# Altium project MDBT42Q.PrjPCB
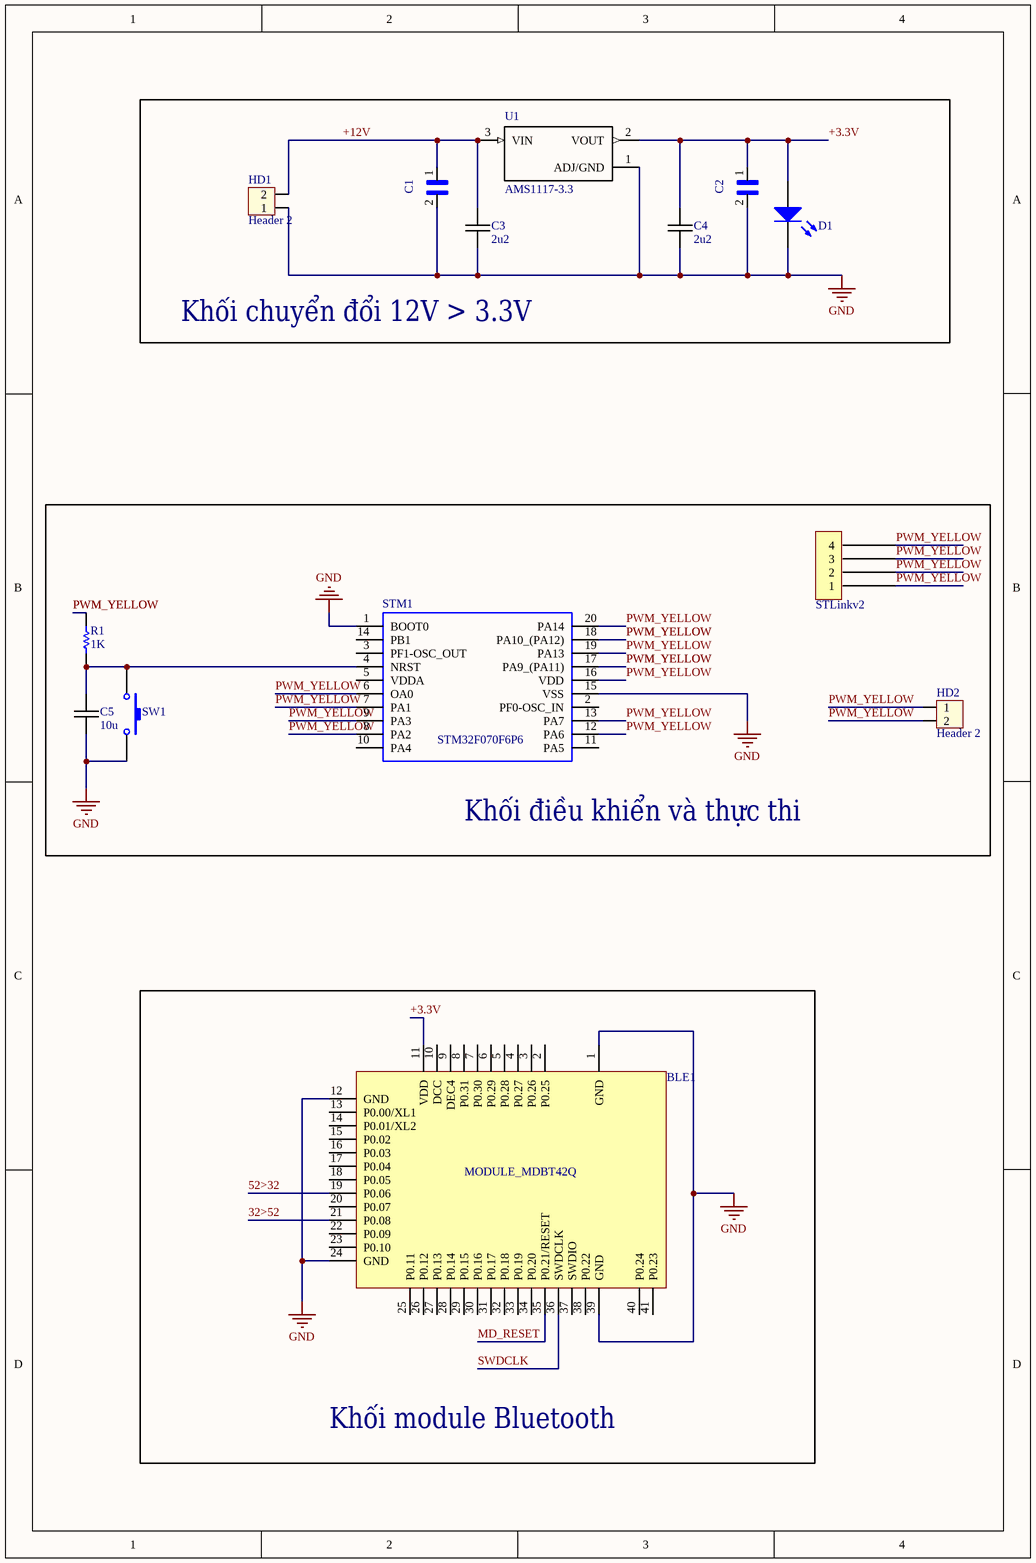
[diagram p0: MDBT42Q.SchDoc]
1 sheet, 14 parts. Net scope: global (net labels, ports and power ports of the same name join across sheets).
Board file: MDBT42Q.PcbDoc

## Sheet MDBT42Q.SchDoc
size A4 portrait

### Parts
BLE1  MODULE_MDBT42Q  [PCB_MDBT42Q_10X16]
C1  C3216X5R1A106K160AB  [CAPC3216X180]  (value not drawn)
C2  C3216X5R1A106K160AB  [CAPC3216X180]  (value not drawn)
C3  2u2  [0805C-GENERIC]
C4  2u2  [0805C-GENERIC]
C5  10u  [0805C-GENERIC]
D1  LED SMD  [LED_0805_Blue]  (value not drawn)
HD1  Header 2  [HED2]
HD2  Header 2  [HED2]
R1  value 1K  [RES-SM-1206]  (hidden comment: RESISTOR SMD)
STLinkv2  JP  [Jumper 4x1]  (value not drawn)
STM1  STM32F070F6P6  [SOP65P640X120-20N]
SW1  SW  [SW2]  (value not drawn)
U1  AMS1117-3.3  [SOT229P700X180-4N]

### Blocks framed on the sheet
Khối chuyển đổi 12V > 3.3V: C1-C4 D1 HD1 U1
Khối điều khiển và thực thi: C5 HD2 R1 STLinkv2 STM1 SW1
Khối module Bluetooth: BLE1

### Nets
GND: BLE1.1(GND) BLE1.12(GND) BLE1.24(GND) BLE1.39(GND) C1.2 C2.2 C3.2 C4.2 C5.2 D1.2(K) HD1.1 STM1.1(BOOT0) STM1.15(VSS) SW1.2 U1.1(ADJ/GND)
32>52: BLE1.21(P0.08)
52>32: BLE1.19(P0.06)
+3.3V: BLE1.11(VDD) C2.1 C4.1 D1.1(A) U1.2(VOUT)
+12V: C1.1 C3.1 HD1.2 U1.3(VIN)
MD_RESET: BLE1.35(P0.21/RESET)
PWM_YELLOW: HD2.1 HD2.2 R1.2 STLinkv2.1 STLinkv2.2 STLinkv2.3 STLinkv2.4 STM1.6(OA0) STM1.7(PA1) STM1.8(PA2) STM1.9(PA3) STM1.12(PA6) STM1.13(PA7) STM1.16(VDD) STM1.17(PA9_(PA11)) STM1.18(PA10_(PA12)) STM1.19(PA13) STM1.20(PA14)
SWDCLK: BLE1.36(SWDCLK)
NetC5_1: C5.1 R1.1 STM1.4(NRST) SW1.1

Not connected (* = marked no-connect by the designer): BLE1 2(P0.25) 3(P0.26) 4(P0.27) 5(P0.28) 6(P0.29) 7(P0.30) 8(P0.31) 9(DEC4) 10(DCC) 13(P0.00/XL1) 14(P0.01/XL2) 15(P0.02) 16(P0.03) 17(P0.04) 18(P0.05) 20(P0.07) 22(P0.09) 23(P0.10) 25(P0.11) 26(P0.12) 27(P0.13) 28(P0.14) 29(P0.15) 30(P0.16) 31(P0.17) 32(P0.18) 33(P0.19) 34(P0.20) 37(SWDIO) 38(P0.22) 40(P0.24) 41(P0.23); STM1 2(PF0-OSC_IN) 3(PF1-OSC_OUT) 5(VDDA) 10(PA4) 11(PA5) 14(PB1)

### Library data of the parts
BLE1 = MODULE_MDBT42Q: MDBT42Q
C1 C2 = C3216X5R1A106K160AB: C Series 1206 10 uF 10 V Â±10 % Tolerance X5R SMT Multilayer Ceramic Capacitor; MF: TDK; SnapEDA_Link: https://www.snapeda.com/parts/C3216X5R1A106K160AB/TDK/view-part/?ref=snap; Availability: Unavailable; Price: 0.19 USD; Package: 1206 TDK; MP: C3216X5R1A106K160AB; Value: *
C3-C5 = 0805C-2U2-6V3-X5R-PAN: CAPACITOR 0805 CERAMIC; Manufacturer Part Number: ECJ-1VB0J225K; Manufacturer: Panasonic - ECG; Reel: C7; Supplier 1: Digi-Key; Supplier Part Number 1: PCC2273TR-ND
D1 = LED SMD: LED
HD1 HD2 = Hed2: Header 2 (Green); Value: Header 2
R1 = RESISTOR SMD: Resistor
STLinkv2 = Jumper 4x1
STM1 = STM32F070F6P6: STMICROELECTRONICS - STM32F070F6P6 - MCU, 32BIT, CORTEX-M0, 48MHZ, TSSOP-20; Geometry.Height: 1.2mm; Manufacturer_Name: STMicroelectronics; Manufacturer_Part_Number: STM32F070F6P6; RS Part Number: *; RS Price/Stock: *; Arrow Part Number: STM32F070F6P6; Arrow Price/Stock: https://www.arrow.com/en/products/stm32f070f6p6/stmicroelectronics; Datasheet Link: http://www.st.com/content/ccc/resource/technical/document/datasheet/31/4f/10/5f/a5/32/46/42/DM00141386.pdf/files/DM00141386.pdf/jcr:content/translations/en.DM00141386.pdf
SW1 = Tact SW - 2Pin: Switch button 2 pin
U1 = AMS1117-3.3: Sot223/Pkg 1-Amp 3.3-Volt Low Drop Out Voltage Regulatator; MF: Advanced Monolithic Systems; SnapEDA_Link: https://www.snapeda.com/parts/AMS1117-3.3/Advanced%20Monolithic%20Systems/view-part/?ref=snap; Availability: Unavailable; MP: AMS1117-3.3; Price: None; Package: None; Value: *